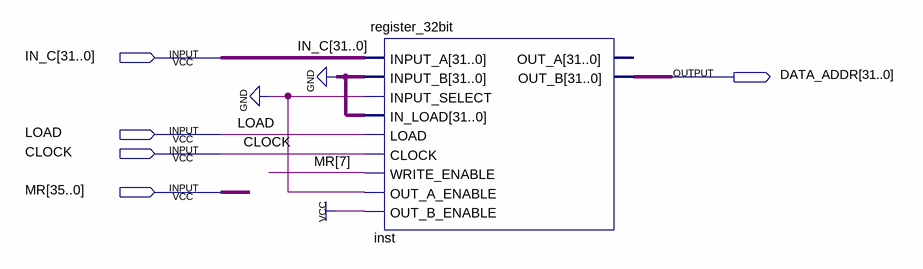
[diagram p0: schematic sheet]
// Quartus schematic MAR.bdf as structural Verilog: 1 symbols, 5 pins
module MAR (
  input  [31:0] IN_C,
  input  LOAD,
  input  CLOCK,
  input  [35:0] MR,
  output [31:0] DATA_ADDR
);

  register_32bit inst (
    .INPUT_A(IN_C), .INPUT_B({32{1'b0}}), .INPUT_SELECT(1'b0), .IN_LOAD({32{1'b0}}), .LOAD(LOAD),
    .CLOCK(CLOCK), .WRITE_ENABLE(MR[7]), .OUT_A_ENABLE(1'b0), .OUT_B_ENABLE(1'b1), .OUT_B(DATA_ADDR));  // open: OUT_A
endmodule
